# EAGLE design SAMD11 Feather 20SOIC (EAGLE 9.4.2)
COMPANY: ADAFRUIT INDUSTRIES; DRAWN: KTOWN; REV: B
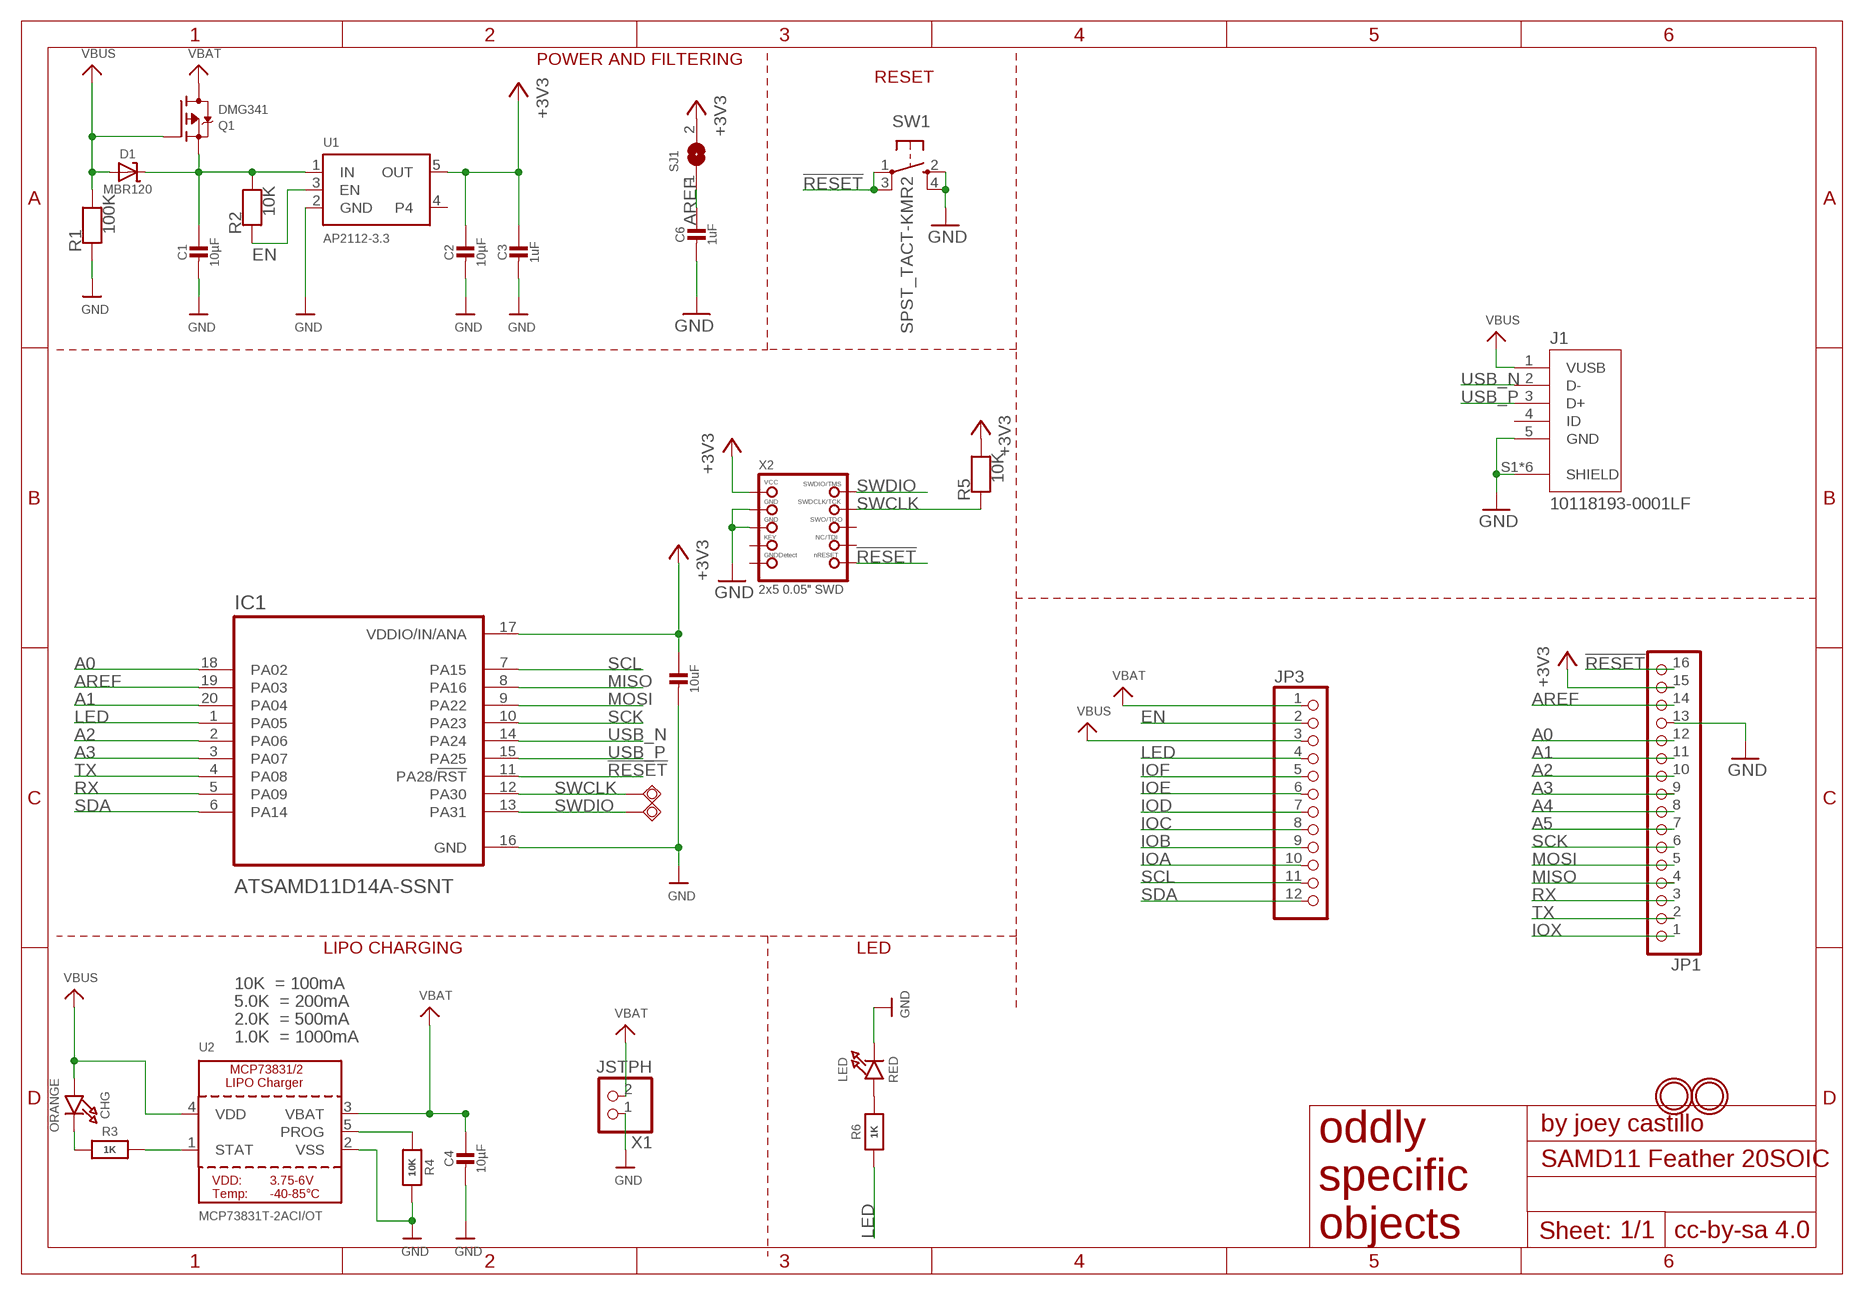
[diagram p0: schematic, sheet 1]

## Parts
C1  10µF  CAP_CERAMIC0805-NOOUTLINE  [0805-NO]
C2  10µF  CAP_CERAMIC0805-NOOUTLINE  [0805-NO]
C3  1uF  CAP_CERAMIC0805-NOOUTLINE  [0805-NO]
C4  10µF  CAP_CERAMIC0805-NOOUTLINE  [0805-NO]
C5  10uF  CAP_CERAMIC0805-NOOUTLINE  [0805-NO]
C6  1uF  CAP_CERAMIC0805-NOOUTLINE  [0805-NO]
CHG  ORANGE  LED0805_NOOUTLINE  [CHIPLED_0805_NOOUTLINE]
D1  MBR120  DIODE-SCHOTTKYSOD-123  [SOD-123]
IC1  ATSAMD11D14A-SSNT  [SOIC127P1030X265-20N]
J1  10118193-0001LF  [FCI_10118193-0001LF]
JP1  HEADER-1X16_MIN  [1X16_ROUND_MIN]
JP3  HEADER-1X12_MIN  [1X12_ROUND_MIN]
LED  RED  LED0805_NOOUTLINE  [CHIPLED_0805_NOOUTLINE]
Q1  DMG341  MOSFET-P  [SOT23-R]
R1  100K  RESISTOR0805_NOOUTLINE  [0805-NO]
R2  10K  RESISTOR0805_NOOUTLINE  [0805-NO]
R3  1K  RESISTOR0805_NOOUTLINE  [0805-NO]
R4  10K  RESISTOR0805_NOOUTLINE  [0805-NO]
R5  10K  RESISTOR0805_NOOUTLINE  [0805-NO]
R6  1K  RESISTOR0805_NOOUTLINE  [0805-NO]
SJ1  SOLDERJUMPERCLOSED  [SOLDERJUMPER_CLOSEDWIRE]
SW1  SPST_TACT-KMR2  [KMR2]
SWCLK  TPSQTP20R  [TP20R]
SWDIO  TPSQTP20R  [TP20R]
U1  AP2112-3.3  VREG_SOT23-5  [SOT23-5]
U2  MCP73831T-2ACI/OT  MCP73831/2  [SOT23-5]
U$31  MOUNTINGHOLE2.5  [MOUNTINGHOLE_2.5_PLATED]
U$32  MOUNTINGHOLE2.5  [MOUNTINGHOLE_2.5_PLATED]
X1  JSTPH  CON_JST_PH_2PIN  [JSTPH2]
X2  2x5 0.05" SWD  JTAG-CORTEXBOXPOSTS  [2X05_1.27MM_BOX_POSTS]

## Nets
!RESET: IC1.11(PA28/!RST) JP1.16 SW1.1(P) SW1.3(P1) X2.10(NRESET)
+3V3 [power]: C2.1 C3.1 C5.1 IC1.17(VDDIO/IN/ANA) JP1.15 R5.2 SJ1.2 U1.5(OUT) X2.1(VCC)
A0: IC1.18(PA02) JP1.12
A1: IC1.20(PA04) JP1.11
A2: IC1.2(PA06) JP1.10
A3: IC1.3(PA07) JP1.9
A4: JP1.8
A5: JP1.7
AREF: C6.1 IC1.19(PA03) JP1.14 SJ1.1
CHG: CHG.C R3.1
EN: JP3.2 R2.1 U1.3(EN)
GND [gnd]: C1.2 C2.2 C3.2 C4.2 C5.2 C6.2 IC1.16(GND) J1.5(GND) J1.S1(SHIELD) J1.S2(SHIELD) J1.S3(SHIELD) J1.S4(SHIELD) J1.S5(SHIELD) J1.S6(SHIELD) JP1.13 LED.C R1.1 R4.2 SW1.2(S) SW1.4(S1) U1.2(GND) U2.2(VSS) X1.1 X2.3(GND) X2.5(GND)
IOA: JP3.10
IOB: JP3.9
IOC: JP3.8
IOD: JP3.7
IOE: JP3.6
IOF: JP3.5
IOX: JP1.1
LED: IC1.1(PA05) JP3.4 R6.1
MISO: IC1.8(PA16) JP1.4
MOSI: IC1.9(PA22) JP1.5
N$1: LED.A R6.2
PROG: R4.1 U2.5(PROG)
RX: IC1.5(PA09) JP1.3
SCK: IC1.10(PA23) JP1.6
SCL: IC1.7(PA15) JP3.11
SDA: IC1.6(PA14) JP3.12
STAT: R3.2 U2.1(STAT)
SWCLK: IC1.12(PA30) R5.1 SWCLK.TP X2.4(SWDCLK)
SWDIO: IC1.13(PA31) SWDIO.TP X2.2(SWDIO)
TX: IC1.4(PA08) JP1.2
USB_N: IC1.14(PA24) J1.2(D-)
USB_P: IC1.15(PA25) J1.3(D+)
VBAT [power]: C4.1 JP3.1 Q1.3(D) U2.3(VBAT) X1.2
VBUS [power]: CHG.A D1.A J1.1(VUSB) JP3.3 Q1.1(G) R1.2 U2.4(VDD)
VHI [power]: C1.1 D1.C Q1.2(S) R2.2 U1.1(IN)
Unconnected: J1.4(ID) U1.4 X2.6(SWO) X2.7(KEY) X2.8(TDI) X2.9(GNDDETECT)

## Notes on the sheet
- POWER AND FILTERING
- RESET
- LIPO CHARGING | LED
- 10K  = 100mA
- 5.0K  = 200mA
- 2.0K  = 500mA
- 1.0K  = 1000mA

## Library data of the parts
C1-C6 = microbuilder:CAP_CERAMIC: Ceramic Capacitors For new designs, use the packages preceded by an '_' character since they are more reliable: The following footprints should be used on most boards: _0402 - Standard footprint for regular board layouts _0603 - Standard footprint for regular board layouts _0805 - Standard footprint for regular board layouts _1206 - Standard footprint for regular board layouts For extremely tight-pitch boards where space is at a premium, the following 'micro-pitch' footprints can be used (smaller pads, no silkscreen outline, etc.): _0402MP - Micro-pitch footprint for very dense/compact boards _0603MP - Micro-pitch footprint for very dense/compact boards _0805MP - Micro-pitch footprint for very dense/compact boards _1206MP - Micro-pitch footprint for very dense/compact boards
CHG LED = microbuilder:LED: LED 0603 - 0603 Surface Mount Package 2mA: Green LED - Low Power (3.9mcd, 2ma, 1.7Vf) - Digikey: 475-2709-2-ND Orange LED - Low Power (9.8mcd, 2ma, 1.8Vf) - Digikey: 475-1194-2-ND Red LED - Low Power (5mcd, 2ma, 1.8Vf) - Digikey: 475-1195-2-ND Yellow LED - Low Power (7mcd, 2ma, 1.8Vf) - Digikey: 475-1196-2-ND 5mA: Blue LED - Low Power (17mcd, 5ma, 2.9Vf) - Digikey: LNJ937W8CRACT-ND 0805 - 0805 Surface Mount Package 2mA: Red LED (8.8mcd, 2mA, 1.8Vf, Clear) - Low Power [Digikey: 475-2510-1-ND] Green LED (5mcd, 2mA, 1.8Vf, Clear) - Low Power [Digikey: 475-2730-1-ND] Yellow LED (11.3mcd, 2mA, 1.8Vf, Clear) - Low Power [Digikey: 475-2555-1-ND] 20mA: Red LED (104mcd, 20mA, Diffused) - LS R976 [Digikey: 475-1278-6-ND] Red LED (12mcd, 20mA, 2.0Vf, Clear) - APT2012EC [Digikey: 754-1128-1-ND] Green LED (15mcd, 20mA, 2.2Vf, Clear) - APT2012GC [Digikey: 754-1131-1-ND] Orange LED (160mcd, 20mA, 2.1Vf, Clear) - APT2012SECK [Digikey: 754-1130-1-ND] 1206 - 1206 Surface Mount Package Green LED (26mcd, 20mA, Diffused) - LG N971 [Digikey: 475-1407-6-ND] Red LED (15mcd, 20mA, Diffused) - LH N974 [Digikey: 475-1416-6-ND] Cree - Cree High-Power Surface Mount LEDs XPEBWT-L1-0000-00D50 - White 111lm 350mA 2.9Vf 6200K 110° XTEAWT-00-0000-00000LEE3 - White 114lm 350mA 2.85Vf 5000K 115° Everlight - Everlight 45-21 Series Surface Mount LEDs 45-21/QK2C-B2832AC2CB2/2T - Warm White 2000mcd 20mA 3.25Vf 3050K 120° 45-21/LK2C-B38452C4CB2/2T - Nuetral White 2000mcd 20mA 3.25Vf 4150K 120° 45-21/LK2C-B50634C6CB2/2T - Cold White 2200mcd 20mA 3.25Vf 5650K 120° PLCC2 Reverse Mount LS T77K-J1L2-1-0-2-R18-Z - Red 11.25mcd 2mA 1.8Vf 630nm 120° LO T77K-L1M2-24-Z - Orange 19.6mcd 2mA 1.8Vf 606nm 120° LY T77K-K2M1-26-Z - Yellow 15.7mcd 2mA 1.8Vf 587nm 120°
D1 = microbuilder:DIODE-SCHOTTKY
IC1 = ATSAMD11D14A-SSNT:ATSAMD11D14A-SSNT: None; AVAILABILITY: Unavailable; DESCRIPTION: Cortex-M0+, 16kb Flash, 4kb Sram, Usb - 20 Soic, 105c, Green, 1.6-3.6v, 48mhz, Usb/ Eiqj/Soic _s_; MF: Microchip; MP: ATSAMD11D14A-SSNT; PACKAGE: SOIC-20 Atmel; PRICE: None
J1 = 10118193-0001LF:10118193-0001LF: Micro USB B Type Receptacle; DESCRIPTION: Single Port 5 Contact Shielded SMT MICRO USB B-Type Receptacle; DIGI-KEY_PART_NUMBER: 609-4616-1-ND; DIGI-KEY_PURCHASE_URL: https://www.digikey.com/product-detail/en/amphenol-icc-fci/10118193-0001LF/609-4616-1-ND/2785380?utm_source=snapeda&utm_medium=aggregator&utm_campaign=symbol; MF: Amphenol ICC; MP: 10118193-0001LF; PACKAGE: None
JP1 = microbuilder:HEADER-1X16: PIN HEADER
JP3 = microbuilder:HEADER-1X12
Q1 = microbuilder:MOSFET-P: P-Channel Mosfet LEGEND VDS: Voltage Drain-Source ID: Drain Current RDS(ON): Drain-Source On-State Resistance VGS(TH): Gate-Source Threshold Voltage CISS: Drain-Source Input Capacitance SOT-23 Name VDS ID RDS(ON) VGS(TH) CISS Order Number IRLML5103 30V 760mA 600 mOhm -- 75pF @ 25V Digikey: IRLML5103PBFCT-ND IRLML6401 12V 4.3A 50 mOhm 950mV @ 250µA 830pF @ 10V Digikey: IRLML6401PBFTR-ND NTR0202PL 20V 400mA 800 mOhm 2.3V @ 250uA 70pF @ 5V Digikey: NTR0202PLT1GOSTR-ND NTR4101PT1G 20V 1.8A 85 mOhm 1.2V @ 250uA 675pF @ 10V Digikey: NTR4101PT1GOSCT-ND DMP2004K 20V 600mA 900 mOhm 1V @ 250uA 175pF @ 16V Digikey: DMP2004KDICT-ND PMV65XP 20V 3.9A 76 mOhm 950mV @ 1mA 725pF @ 20V Digikey: 568-2358-2-ND TO-252 Name VDS ID RDS(ON) VGS(TH) CISS Order Number AOD417 30V 25A 34 mOhm 3V @ 250µA 920pF @ 15V Digikey: 785-1106-2-ND PowerPak Name VDS ID RDS(ON) VGS(TH) CISS Order Number AON7401 30V 12A 14 mOhm 3V @ 250µA 2600pF @ 15V Digikey: 785-1302-1-ND
R1-R6 = microbuilder:RESISTOR: Resistors For new designs, use the packages preceded by an '_' character since they are more reliable: The following footprints should be used on most boards: _0402 - Standard footprint for regular board layouts _0603 - Standard footprint for regular board layouts _0805 - Standard footprint for regular board layouts _1206 - Standard footprint for regular board layouts For extremely tight-pitch boards where space is at a premium, the following 'micro-pitch' footprints can be used (smaller pads, no silkscreen outline, etc.): _0402MP - Micro-pitch footprint for very dense/compact boards _0603MP - Micro-pitch footprint for very dense/compact boards _0805MP - Micro-pitch footprint for very dense/compact boards _1206MP - Micro-pitch footprint for very dense/compact boards
SJ1 = microbuilder:SOLDERJUMPER: SMD Solder JUMPER Solder the two pads together to create a connection, or remove the solder to break it. REFLOW - Use this footprint for solder paste and reflow ovens. WAVE - Use this footprint for hand-soldering (larger pads). CLOSED - Has a trace between the two pads to ensure it is closed by default. The trace needs to be cut to disable the jumper, and can be closed again by creating a solder bridge between the two pads.
SW1 = adafruit:SPST_TACT: SMT 6mm switch, EVQQ2 series http://www.ladyada.net/library/eagle
SWCLK SWDIO = testpad:TPSQ: Test pad
U1 = microbuilder:VREG_SOT23-5: SOT23-5 Fixed Voltage Regulators Part Current Out V Out V In V Dropout θJA (°C/W) TJ (°C) Digikey Part No. ADP121 150mA 3.3V 3.4-5.5V 0.09V @ 150mA -- -- ADP121-AUJZ33R7CT-ND ADP121 150mA 3.0V 3.1-5.5V 0.09V @ 150mA -- -- ADP121-AUJZ30R7CT-ND ADP122 300mA 3.3V 3.4-5.5V 0.085V @ 300mA -- -- ADP122AUJZ-3.3-R7CT-ND ADP1712 300mA 3.3V 3.5-5.5V 0.17V @ 300mA -- -- ADP1712AUJZ-3.3-R7TR-ND AP7311 (Low Cost) 150mA 3.3V 3.5-6V 0.15V @ 150mA -- -- AP7311-33WG-7DICT-ND LD39015M18R 150mA 1.8V 1.9V-5.5V 0.08V @ 100mA -- -- 497-6977-1-ND LP2985A-33DBVR 150mA 3.3V 3.3-16V 0.28V @ 150mA 206 150 296-18479-1-ND MCP1824T-3302E/OT 300mA 3.3V 3.5V-6V 0.2V @ 300mA -- -- MCP1824T-3302E/OTCT-ND MIC5205-2.5YM5 TR 150mA 2.5V 2.7-16V 0.165V @ 150mA -- -- 576-1257-2-ND MIC5205-3.0YM5 TR 150mA 3.0V 3.2V-16V 0.165V @ 150mA -- -- 576-1258-2-ND MIC5205-3.3YM5 TR 150mA 3.3V 3.5V-16V 0.165V @ 150mA -- -- 576-1259-2-ND TPS780330220 150mA 3.3V+2.2V 3.6-5.5V 250mV Max -- -- 296-23332-1-ND TDA3663/N1,135 100mA 3.3V 3.5-45V 0.18V @ 50mA -- -- 568-5343-1-ND Max operating temp can be calculated using θJA, TJ (max junction temperature), and power in watts. Set the "Maximum Ambient Temperature" until it reaches TJ ("Max Junction Temperature"), which is the absolute limit for safe use of the regulator: Heat Sink Temperature Calculator <http://www.daycounter.com/Calculators/Heat-Sink-Temperature-Calculator.phtml> For example, With 12V source into a 3.3V LP2985 and a 30mA load, we are dissipating (12V-3.3V) * 0.03A = 0.261W. With a θJA of 206 °C/W, a TJ of 150°C, and 261mW we can safely use the chip without a heat sink up to 75°C (=147.1°C Junction Temperature).
U2 = microbuilder:MCP73831/2: MCP73831/2 LIPO Charger VDD: 3.75 - 6V Temp -40 - 85°C Programmable Charge Rate: 15-500mA NOTE: STAT is a tri-state logic output on the MCP73831 and an open-drain output on the MCP73832. SOT23-5 with 4.2V output and tri-state logic on STAT = MCP73831T-2ACI/OT
U$31 U$32 = microbuilder:MOUNTINGHOLE: Mounting Hole For #2 screws (0.086"/2.18mm width, 0.094"/2.4mm hole) use 2.5mm; BOM: EXCLUDE
X1 = microbuilder:CON_JST_PH_2PIN: JST 2-Pin Right-Angle Connector PH-Series - 4UConnector: 17311 SH-Series - 4UConnector: 07278
X2 = microbuilder:JTAG-CORTEX: Serial Wire (SW-DP) Connector Standard 0.05" 10-pin connector is for use with the Cortex M and Cortex A SWD (serial wire debugger) interface (SW-DP) Connectors 2x05_1.27MM_SMT - Inexpensive surface-mount header with bare pins, compatible with standard 10-pin SWD cables (4UCON: 16846) 2x05_1.27MM_BOX_NOPOSTS - Polarised surface-mount box (4UCON with caps: 19735, without caps: 15117 2x05_1.27MM_BOX_POSTS - Polarised surface-mount box with mounting holes (4UCON: 20317) Pinout: http://infocenter.arm.com/help/topic/com.arm.doc.faqs/attached/13634/cortex_debug_connectors.pdf http://www.keil.com/peripherals/coresight/connectors.asp

## Net classes
0 default: width 0.254 mm, drill 0.254 mm
1 power: width 0.305 mm, drill 0.305 mm
2 gnd: width 0.254 mm, drill 0.254 mm

## Board
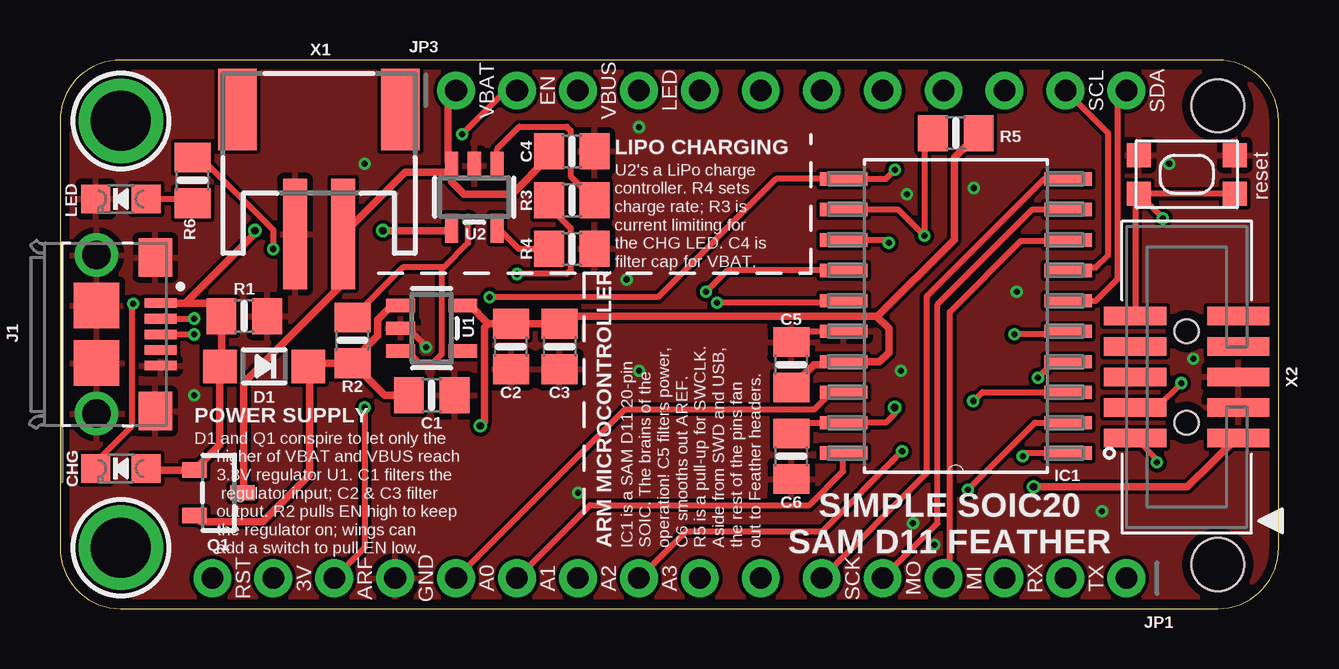
[diagram p1: board, top side]
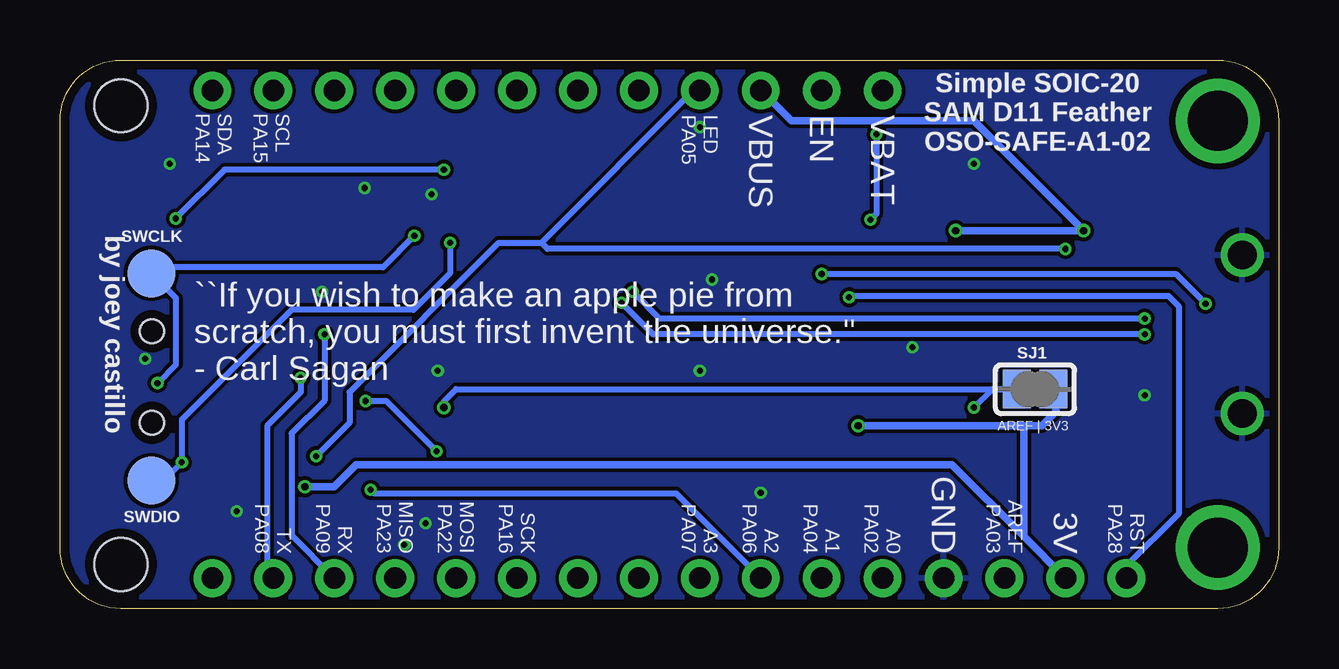
[diagram p2: board, bottom side, seen from below]

Size 50.8 x 22.86 mm. Coordinates in mm from the lower left corner, seen from the top.
Outline: 2.54,0 48.26,0 arc90 50.8,2.54 50.8,20.32 arc90 48.26,22.86 2.54,22.86 arc90 0,20.32 0,2.54 arc90 2.54,0
Copper layers (1*16): Top 0.035559375mm / dielectric 1.6mm / Bottom 0.035559375mm
Design rules "oshpark-2layer *": minimum track width 6mil, minimum drill 10mil, track to track 6mil, track to pad 6mil, pad to pad 6mil, via to via 6mil, smd to smd 6mil, copper to edge 15mil, drill to drill 6mil, minimum pad ring 5mil, minimum via ring 5mil, stop-mask expansion 2.5mil, vias tented up to drill 12mil, thermal gap 10mil
Holes 2.2 mm at 48.26,1.84 48.26,20.95

### Footprints (pad centres in the part's own frame; a part is rotated, then mirrored left to right if it is on the bottom)
0805-NO = smd 1.24 x 1.5: 1 -0.95,0; 2 0.95,0
CHIPLED_0805_NOOUTLINE = smd 1.2 x 1.2: A 0,-1.05; C 0,1.05
SOD-123 = smd 1.4 x 1.4: A 1.85,0; C -1.85,0
SOIC127P1030X265-20N = smd 1.981 x 0.559: 1 -4.674,5.715; 2 -4.674,4.445; 3 -4.674,3.175; 4 -4.674,1.905; 5 -4.674,0.635; 6 -4.674,-0.635; 7 -4.674,-1.905; 8 -4.674,-3.175; 9 -4.674,-4.445; 10 -4.674,-5.715; 11 4.674,-5.715; 12 4.674,-4.445; 13 4.674,-3.175; 14 4.674,-1.905; 15 4.674,-0.635; 16 4.674,0.635; 17 4.674,1.905; 18 4.674,3.175; 19 4.674,4.445; 20 4.674,5.715
FCI_10118193-0001LF = smd 0.4 x 1.35: 1 -1.3,2.675; 2 -0.65,2.675; 3 0,2.675; 4 0.65,2.675; 5 1.3,2.675 | smd 1.6 x 1.4: S1 -3.2,2.45; S2 3.2,2.45 | smd 1.9 x 1.9: S3 1.2,0; S4 -1.2,0 | drill 1.2: S5 3.302,0; S6 -3.302,0
1X16_ROUND_MIN = drill 0.9 pad 1.575: 1 -19.05,0; 2 -16.51,0; 3 -13.97,0; 4 -11.43,0; 5 -8.89,0; 6 -6.35,0; 7 -3.81,0; 8 -1.27,0; 9 1.27,0; 10 3.81,0; 11 6.35,0; 12 8.89,0; 13 11.43,0; 14 13.97,0; 15 16.51,0; 16 19.05,0
1X12_ROUND_MIN = drill 0.9 pad 1.575: 1 -13.97,0; 2 -11.43,0; 3 -8.89,0; 4 -6.35,0; 5 -3.81,0; 6 -1.27,0; 7 1.27,0; 8 3.81,0; 9 6.35,0; 10 8.89,0; 11 11.43,0; 12 13.97,0
SOT23-R = smd 0.635 x 1.016: 1 -0.95,-1; 2 0.95,-1; 3 0,1
SOLDERJUMPER_CLOSEDWIRE = smd 1.168 x 1.6: 1 -0.762,0; 2 0.762,0 | smd 0.635 x 0.203: WIRE 0,0
KMR2 = smd 1 x 1: 1 2,0.8; 2 2,-0.8; 3 -2,0.8; 4 -2,-0.8
TP20R = smd 2 x 2: TP 0,0
SOT23-5 = smd 0.55 x 1.2: 1 -0.95,-1.3; 2 0,-1.3; 3 0.95,-1.3; 4 0.95,1.3; 5 -0.95,1.3
MOUNTINGHOLE_2.5_PLATED = drill 2.5 pad 3.2: P$1 0,0
JSTPH2 = smd 1 x 4.6: 1 -1,-3.7; 2 1,-3.7 | smd 1.6 x 3.4: NC1 -3.4,1.5; NC2 3.4,1.5
2X05_1.27MM_BOX_POSTS = smd 0.76 x 2.6: 1 -2.54,-2.15; 2 -2.54,2.15; 3 -1.27,-2.15; 4 -1.27,2.15; 5 0,-2.15; 6 0,2.15; 7 1.27,-2.15; 8 1.27,2.15; 9 2.54,-2.15; 10 2.54,2.15 | hole 1: -1.905,0; 1.905,0

### Placement (x,y rotation side)
C1  15.49,8.89 0 top
C2  18.8,10.92 270 top
C3  20.83,10.92 270 top
C4  21.34,19.05 0 top
C5  30.48,10.16 90 top
C6  30.48,6.35 270 top
CHG  2.54,5.84 90 top
D1  8.51,10.1 180 top
IC1  37.34,12.19 180 top
J1  1.52,11.43 270 top
JP1  25.4,1.27 180 top
JP3  30.48,21.59 0 top
LED  2.54,17.07 90 top
Q1  6.6,4.83 270 top
R1  7.68,12.19 180 top
R2  12.19,11.18 270 top
R3  21.34,17.02 0 top
R4  21.34,14.99 0 top
R5  37.34,19.81 0 top
R6  5.52,17.84 270 top
SJ1  10.16,9.14 0 bottom
SW1  46.96,18.1 180 top
SWCLK  46.99,13.97 0 bottom
SWDIO  46.99,5.33 0 bottom
U1  15.49,11.68 270 top
U2  17.27,17.14 180 top
U$31  2.54,20.32 270 top
U$32  2.54,2.54 270 top
X1  10.79,19.3 0 top
X2  46.96,9.65 90 top

### Tracks (layer width: path | path; a pad name or v marks a point on that pad's centre or on a via)
!RESET  (via drill 0.25)
  Top 0.254: SW1.3 SW1.1 | SW1.1 44.81,17.15 X2.10 | v34.8,18.29 34.42,17.91 IC1.11 29.85,17.91 24.92,12.97 v17.91,12.97 | SW1.1 45.97,16.29 v45.97,16.26
  Bottom 0.254: v34.8,18.29 43.94,18.29 v45.97,16.26 | v17.91,12.97 17.85,13.03 4.6,13.03 4.17,12.61 4.17,3.95 6.35,1.78 JP1.16
+3V3  (via drill 0.3)
  Top 0.305: U1.5 17.08,12.63 17.85,11.87 | 17.85,11.87 C2.1 C3.1 21.03,11.87 21.34,12.18 34.05,12.18 34.06,12.17 | 17.85,11.87 17.7,11.72 17.7,7.79 v17.53,7.62 | C5.1 31.43,10.16 32.54,10.16 IC1.17 34.16,10.29 34.54,10.67 34.54,11.68 34.06,12.17 | R5.2 37.27,18.8 37.27,15.38 34.06,12.17 | X2.1 49.08,7.11 46.99,5.08 v40.59,5.08
  Bottom 0.305: SJ1.2 9.28,9.03 9.28,8.21 9.87,7.62 10.63,7.62 | v17.53,7.62 10.63,7.62 | JP1.15 10.63,3.01 | 10.63,3.01 10.63,7.62 | v40.59,5.08 39.37,5.08 38.46,5.99 13.61,5.99 10.63,3.01
A0
  Top 0.254: JP1.12 23.55,8.31 31.45,8.31 32.16,9.02 IC1.18
A1
  Top 0.254: IC1.20 32.64,6.48 32.64,5.71 31.24,4.32 22.1,4.32 JP1.11
A2  (via drill 0.25)
  Top 0.254: v37.85,4.95 40.64,7.75 IC1.2
  Bottom 0.254: v37.85,4.95 37.69,4.8 25.12,4.8 JP1.10
A3  (via drill 0.25)
  Top 0.254: JP1.9 26.09,3.23 31.78,3.23 v35.1,6.55 | v38.07,8.65 38.09,8.65 38.46,9.02 IC1.3
  Bottom 0.254: v38.07,8.65 37.2,8.65 v35.1,6.55
AREF  (via drill 0.25, 0.3)
  Top 0.254: C6.1 30.93,7.75 IC1.19 34.42,7.75 34.8,8.13 v34.8,8.38 | v12.7,8.38 12.7,2.54 JP1.14
  Bottom 0.254: v34.8,8.38 34.8,8.64 34.29,9.14 SJ1.1 11.94,9.14 v12.7,8.38
CHG  (via drill 0.25)
  Top 0.254: R3.1 20.39,16.75 21.29,15.85 21.29,14.1 21.13,13.95 v19.05,13.95 | v3.05,12.7 3,12.65 3,7.6 1.49,6.1 CHG.C
  Bottom 0.254: v19.05,13.95 4.29,13.95 v3.05,12.7
EN  (via drill 0.25)
  Top 0.254: R2.1 14.29,14.22 16,14.22 | 16,14.22 17.02,15.24 v17.02,16.2 | 16,14.22 15.91,14.13 15.91,10.61 15.55,10.25 14.98,10.25 14.5,10.73 U1.3 | JP3.2 18.59,21.59 v16.76,19.76
  Bottom 0.254: v16.76,19.76 16.76,16.46 v17.02,16.2
GND  (via drill 0.25)
  Top 0.254: C5.2 30.93,11.56 IC1.16 | v15.27,10.89 15.07,11.08 15.07,11.12 14.51,11.68 U1.2
  other vias: 35.05,9.91 39.88,13.21 12.7,18.54 46.23,18.54 24.13,20.07 35.31,17.27 47.24,10.41 24.13,9.91 21.59,4.83 23.62,13.72 5.59,8.89 43.43,4.06 38.1,17.53 35.56,3.56 36.45,2.67
  pour Top: -0.25,22.86 -0.25,0 50.93,0 50.93,22.86
  pour Bottom: 0,0 51.18,0 51.18,22.86 0,22.86
LED  (via drill 0.25)
  Top 0.254: IC1.1 40.26,6.48 v40.13,6.35 | v8.89,14.99 8.89,15.78 5.87,18.79 R6.1
  Bottom 0.254: v40.13,6.35 38.73,7.75 38.73,9.02 32.51,15.24 30.73,15.24 | 30.73,15.24 24.38,21.59 JP3.4 | v8.89,14.99 30.48,14.99 30.73,15.24
MISO
  Top 0.254: 37.08,1.52 37.08,12.36 40.05,15.32 41.97,15.32 IC1.8
  Top 0.305: JP1.4 37.08,1.52
MOSI
  Top 0.254: JP1.5 36.58,3.56 36.58,12.68 40.53,16.64 IC1.9
N$1
  Top 0.254: LED.A 5.35,17.07 R6.2
PROG
  Top 0.254: U2.5 18.26,15.85 19.12,14.99 R4.1
RX  (via drill 0.25)
  Top 0.254: IC1.5 41.88,11.43 v39.78,11.43
  Bottom 0.254: v39.78,11.43 39.78,8.67 41.15,7.3 41.15,3.05 JP1.3
SCK
  Top 0.254: JP1.6 36.12,5.64 36.12,13.01 41.02,17.91 IC1.10
SCL
  Top 0.254: IC1.7 42.14,14.22 43.18,14.22 43.69,14.73 43.69,19.81 JP3.11
SDA
  Top 0.254: IC1.6 43.17,12.83 44.09,13.75 44.09,21.23 JP3.12
STAT
  Top 0.254: R3.2 21.29,18.02 21.29,19.92 21.12,20.08 19.14,20.08 18.22,19.16 U2.1
SWCLK  (via drill 0.25)
  Top 0.254: v46.74,9.4 45.72,8.38 X2.4 | IC1.12 34.92,16.64 v36.03,15.53 36.03,19.45 R5.1
  Bottom 0.254: v46.74,9.4 45.96,10.18 45.96,12.94 SWCLK.TP 46.74,14.22 37.34,14.22 v36.03,15.53
SWDIO  (via drill 0.25)
  Top 0.254: v45.72,6.1 45.72,6.21 X2.2 | IC1.13 34.42,15.37 v34.54,15.24
  Bottom 0.254: v34.54,15.24 34.54,13.97 36.07,12.45 41.15,12.45 45.72,7.87 v45.72,6.1 46.48,5.33 SWDIO.TP
TX  (via drill 0.25)
  Top 0.254: IC1.4 41.43,10.29 v40.77,9.63
  Bottom 0.254: v40.77,9.63 40.77,9.02 42.16,7.62 42.16,1.52 JP1.2
USB_N  (via drill 0.25)
  Top 0.254: v5.59,12.09 v5.58,12.08 J1.2 | IC1.14 27.81,14.1 v26.92,13.21
  Bottom 0.254: v5.59,12.09 25.8,12.09 v26.92,13.21
USB_P  (via drill 0.25)
  Top 0.254: v5.59,11.43 v5.58,11.43 J1.3 | IC1.15 32.58,12.74 v27.39,12.74
  Bottom 0.254: v5.59,11.43 26.07,11.43 v27.39,12.74
VBAT
  Top 0.305: U2.3 16.07,18.19 14.38,18.19 X1.2 11.79,13.55 7.66,9.42 7.66,4.89 Q1.3 | U2.3 16.17,18.6 16.17,21.25 JP3.1 | U2.3 16.32,17.79 16.84,17.27 18.84,17.27 20.39,18.82 C4.1
VBUS  (via drill 0.3)
  Top 0.305: v8.13,15.75 8.13,15.64 5.21,12.73 J1.1 6.2,12.73 R1.2 6.73,10.17 D1.A 6.66,6.83 Q1.1 3.66,5.78 CHG.A | v13.46,15.75 16.23,15.75 U2.4
  Bottom 0.305: JP3.3 20.32,20.32 12.7,20.32 v8.13,15.75 v13.46,15.75
VHI
  Top 0.305: C1.1 13.53,8.89 R2.2 | R2.2 10.49,10.23 D1.C 10.41,10.04 10.41,5.59 8.45,3.62 5.86,3.62 Q1.2 | U1.1 14.08,12.52 13.72,12.52 13.25,12.04 13.25,11.37 12.19,10.31 R2.2

### Text on the board
tPlace: VBAT | EN | VBUS | LED | SCL | SDA | LIPO CHARGING | U2's a LiPo charge / controller. R4 sets / charge rate; R3 is / current limiting for / the CHG LED. C4 is / filter cap for VBAT. | reset | POWER SUPPLY | D1 and Q1 conspire to let only the / higher of VBAT and VBUS reach / 3.3V regulator U1. C1 filters the / regulator input; C2 & C3 filter / output. R2 pulls EN high to keep / the regulator on; wings can / add a switch to pull EN low. | SIMPLE SOIC20 / SAM D11 FEATHER | ARM MICROCONTROLLER | IC1 is a SAM D11 20-pin / SOIC. The brains of the / operation! C5 filters power, / C6 smooths out AREF. / R5 is a pull-up for SWCLK. / Aside from SWD and USB, / the rest of the pins fan / out to Feather headers. | RST | 3V | ARF | GND | A0 | A1 | A2 | A3 | SCK | MO | MI | RX | TX
bPlace: Simple SOIC-20 / SAM D11 Feather / OSO-SAFE-A1-02 | VBAT | EN | VBUS | LED / PA05 | SCL / PA15 | SDA / PA14 | ``If you wish to make an apple pie from / scratch, you must first invent the universe.'' / - Carl Sagan | by joey castillo | AREF | 3V3 | RST / PA28 | 3V | AREF / PA03 | GND | A0 / PA02 | A1 / PA04 | A2 / PA06 | A3 / PA07 | SCK / PA16 | MOSI / PA22 | MISO / PA23 | RX / PA09 | TX / PA08
bStop: @josecastillo